# EAGLE design breeze (EAGLE 6.5.0)
AUTHOR: Brad Campbell; REV: A; TITLE: Breeze
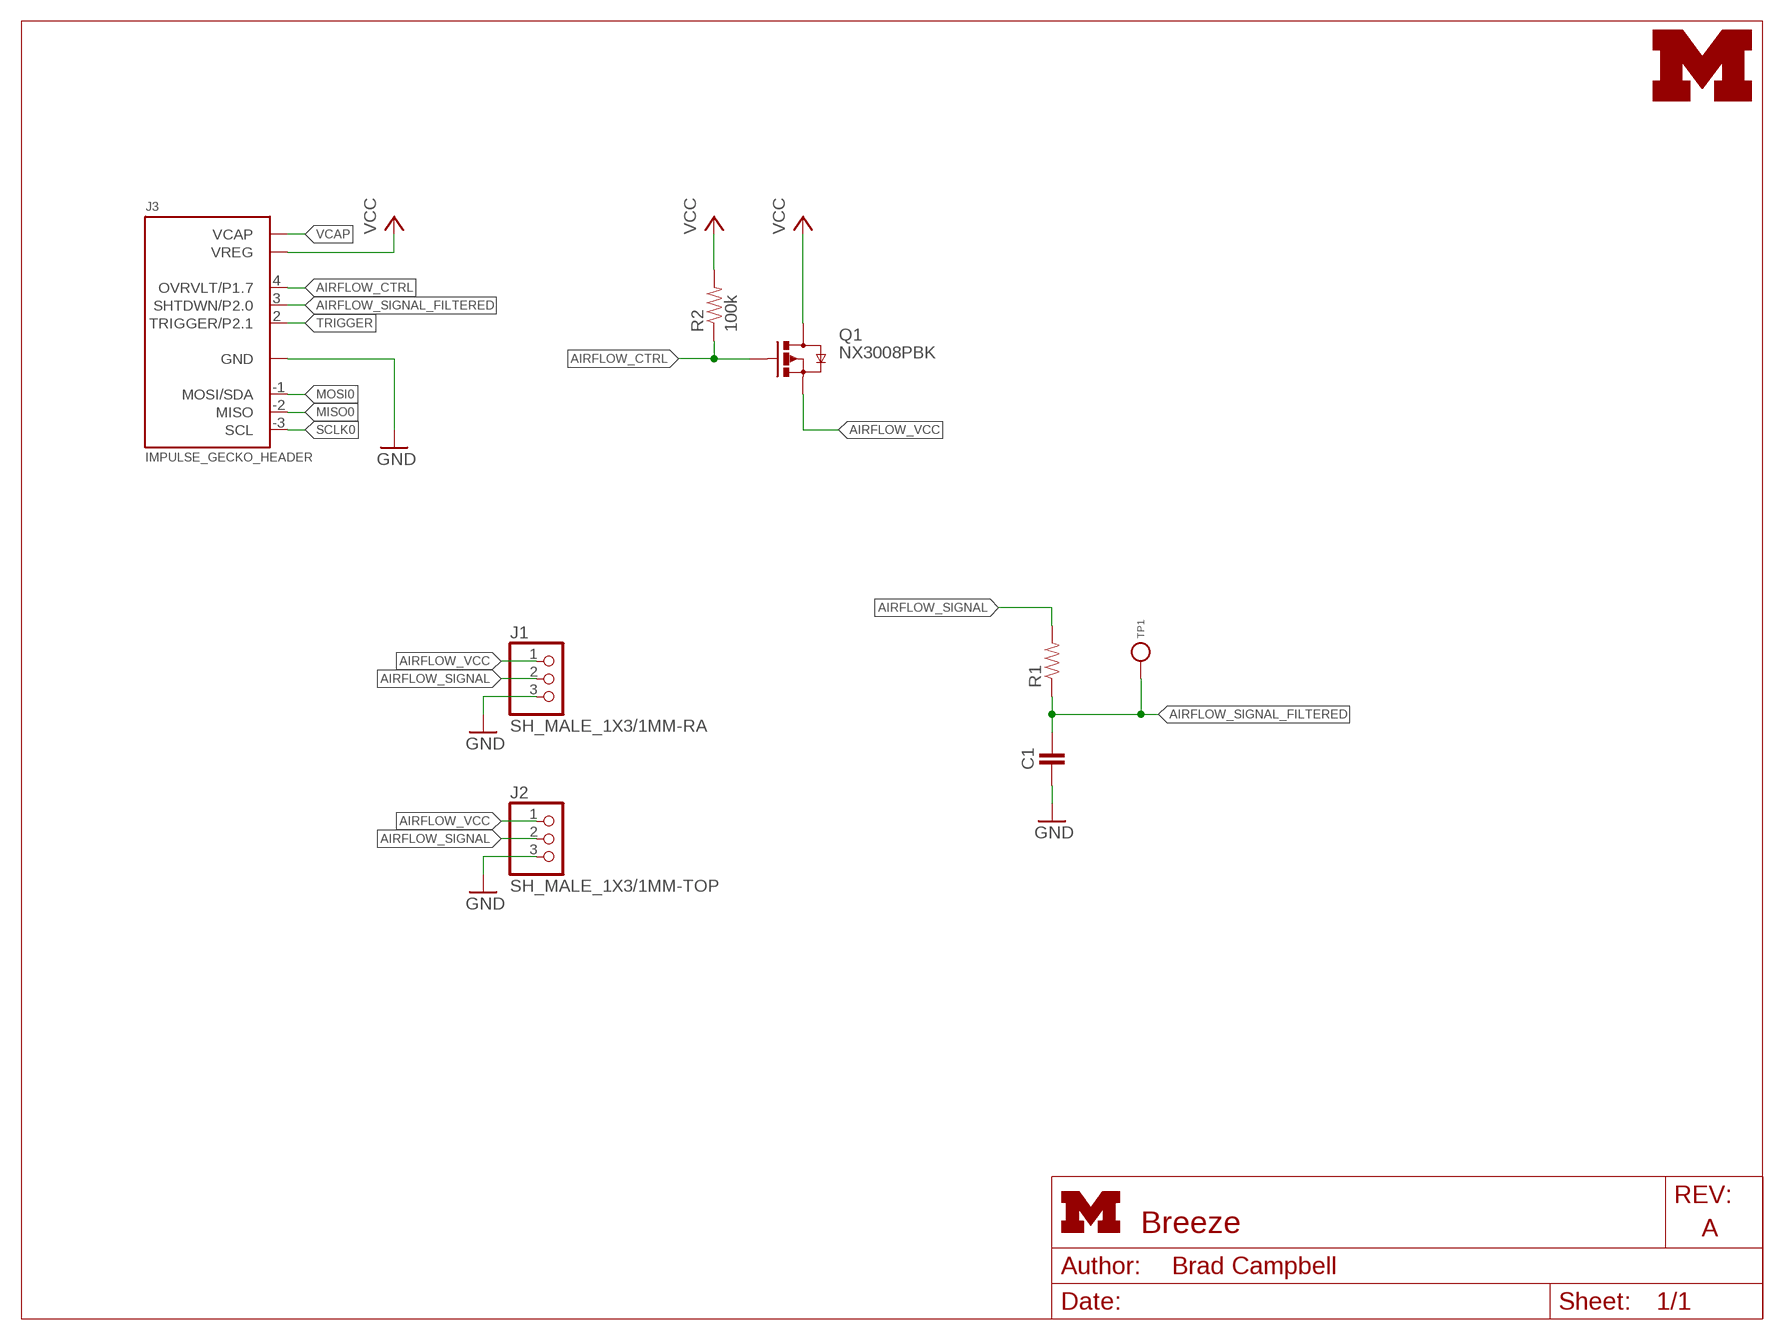
[diagram p0: schematic, sheet 1]
FRAME1 (LETTER_L): HEIGHT: 8.5in; WIDTH: 11in

## Parts
C1  CAPACITOR  [0402_CAP]
J1  SH_MALE_1X3/1MM-RA  [1X3/SMD/SH/RA/1MM]
J2  SH_MALE_1X3/1MM-TOP  [1X3/SMD/SH/1MM]
J3  IMPULSE_GECKO_HEADER  [HEADER1X9/0.05IN]
LOGO1  UMICH_SOLID_TINY  [UMICH_SOLID_50MIL]
Q1  NX3008PBK  [SOT23-3]
R1  RESISTOR0402_RES  [0402_RES]
R2  100k  RESISTOR0402_RES  [0402_RES]
TP1  TEST_POINT_0.040IN  [TESTPOINT_0.040IN]

## Nets
AIRFLOW_CTRL: J3.4(OVRVLT/P1.7) Q1.1(G) R2.1
AIRFLOW_SIGNAL: J1.2 J2.2 R1.2
AIRFLOW_SIGNAL_FILTERED: C1.1 J3.3(SHTDWN/P2.0) R1.1 TP1.TESTPOINT
AIRFLOW_VCC: J1.1 J2.1 Q1.2(S)
GND: C1.2 J1.3 J2.3 J3.0(GND)
MISO0: J3.-2(MISO)
MOSI0: J3.-1(MOSI/SDA)
SCLK0: J3.-3(SCL)
TRIGGER: J3.2(TRIGGER/P2.1)
VCAP: J3.5(VCAP)
VCC: J3.1(VREG) Q1.3(D) R2.2

## Library data of the parts
C1 = passives:CAPACITOR: 0402 Capacitor
J1 = headers:SH_MALE_1X3/1MM: CONN HEADER SH 3POS TOP 1MM TIN; DIGIKEY: 455-1803-1-ND
J2 = headers:SH_MALE_1X3/1MM: CONN HEADER SH 3POS TOP 1MM TIN; DIGIKEY: 455-1789-1-ND
J3 = gecko:IMPULSE_GECKO_HEADER: Header on the impulse EPIC-esque board.
LOGO1 = logos:UMICH_SOLID
Q1 = fets:NX3008PBK: MOSFET - P Channel; DIGIKEY: 568-10499-1-ND; MOUSER: 771-NX3008PBK,215; NEWARK: 74T4665
R1 R2 = passives:RESISTOR: Resistor Basic schematic elements and footprints for 0603, 1206, and PTH resistors.
TP1 = headers:TEST_POINT_0.040IN: 0.040in Test Point; DIGIKEY: 5001K-ND

## Board
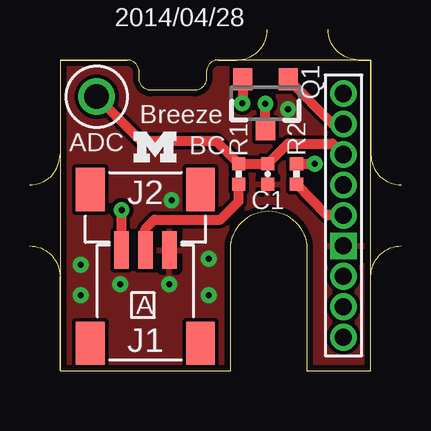
[diagram p1: board, top side]
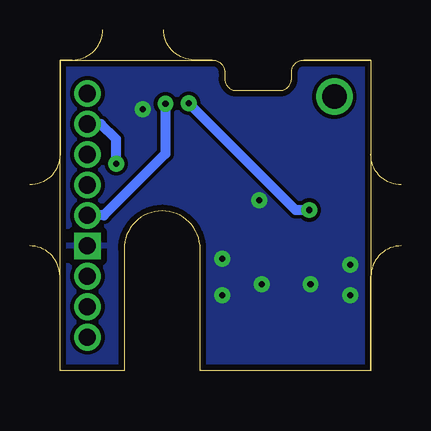
[diagram p2: board, bottom side, seen from below]

Size 12.95 x 12.95 mm. Coordinates in mm from the lower left corner, seen from the top.
Outline: 0,0 7.11,0 7.11,5.08 arc-180 10.29,5.08 10.29,0 12.95,0 12.95,12.95 6.6,12.95 arc90 6.1,12.45 6.1,12.19 arc-90 5.59,11.68 3.81,11.68 arc-90 3.3,12.19 3.3,12.45 arc90 2.79,12.95 0,12.95 0,0
Copper layers (1*16): Top 0.0178mm / dielectric 59mil / Bottom 0.0178mm
Design rules "sunstone-2lyr_v1.0.0.3 *": minimum track width 6mil, minimum drill 14mil, track to track 6mil, track to pad 6mil, pad to pad 6mil, via to via 6mil, smd to smd 6mil, copper to edge 10mil, drill to drill 16mil, minimum pad ring 8mil, minimum via ring 8mil, stop-mask expansion 3mil, vias tented up to drill 100mil, thermal gap 10mil
Milling: 25 lines

### Footprints (pad centres in the part's own frame; a part is rotated, then mirrored left to right if it is on the bottom)
0402_CAP = smd 0.536 x 0.546: 1 -0.433,0; 2 0.433,0
1X3/SMD/SH/RA/1MM = smd 0.6 x 1.55: 1 -1,4.775; 2 0,4.775; 3 1,4.775 | smd 1.2 x 1.8: MOUNT1 -2.3,0.9; MOUNT2 2.3,0.9
1X3/SMD/SH/1MM = smd 0.6 x 1.55: 1 -1,-3.425; 2 0,-3.425; 3 1,-3.425 | smd 1.2 x 1.8: MOUNT1 -2.3,-0.9; MOUNT2 2.3,-0.9
HEADER1X9/0.05IN = drill 0.711 pad 1.016 square: 0 -1.27,0 | drill 0.711 pad 1.016: 1 0,0; 2 1.27,0; 3 2.54,0; 4 3.81,0; 5 5.08,0; -1 -2.54,0; -2 -3.81,0; -3 -5.08,0
SOT23-3 = smd 0.8 x 0.9: 1 -0.95,-1; 2 0.95,-1; 3 0,1.1
0402_RES = smd 0.536 x 0.546: 1 -0.433,0; 2 0.433,0
TESTPOINT_0.040IN = drill 1.016: TESTPOINT 0,0

### Placement (x,y rotation side)
C1  8.66,8.2 270 top
J1  3.56,0.25 0 top
J2  3.56,8.46 0 top
J3  11.81,6.48 90 top
LOGO1  3.96,9.32 0 top
Q1  8.56,11.15 180 top
R1  7.44,8.2 270 top
R2  9.86,8.2 270 top
TP1  1.52,11.43 0 top

### Tracks (layer width: path | path; a pad name or v marks a point on that pad's centre or on a via)
AIRFLOW_CTRL  (via drill 0.25)
  Top 0.406: J3.4 11.37,10.29 Q1.1 | R2.1 v10.62,8.64
  Bottom 0.406: v10.62,8.64 10.62,9.65 11.25,10.29 J3.4
AIRFLOW_SIGNAL
  Top 0.305: J2.2
  Top 0.406: J2.2 3.56,5.92 3.94,6.3 6.68,6.3 7.44,7.06 R1.2
AIRFLOW_SIGNAL_FILTERED
  Top 0.406: TP1.TESTPOINT 3.38,9.58 6.5,9.58 R1.1 C1.1 9.5,9.47 11.35,9.47 J3.3
AIRFLOW_VCC  (via drill 0.25)
  Top 0.305: J2.1
  Top 0.406: Q1.2 7.61,11.17 v7.59,11.15 | v2.56,6.71 2.56,6.7 J2.1
  Bottom 0.406: v7.59,11.15 3.15,6.71 v2.56,6.71
GND  (via drill 0.25)
  other vias: 6.2,4.67 6.2,3.15 0.86,4.42 0.86,3.15 4.55,3.61 4.65,7.11 9.5,10.9 2.51,3.61
  pour Top: 13.46,13.72 13.46,-0.51 -0.58,-0.51 -0.58,13.72
  pour Bottom: -0.56,13.72 13.46,13.72 13.46,-0.51 -0.56,-0.51
VCC  (via drill 0.25)
  Top 0.406: J3.1 11.12,6.48 R2.2 | Q1.3 v8.56,11.12
  Bottom 0.406: v8.56,11.12 8.56,9.04 11.12,6.48 J3.1

### Text on the board
tPlace: 2014/04/28 | Breeze | ADC | BC | A
tDocu: VCAP | OV | SHTD | TRIG | VREG | GND | MOSI | MISO | SCL